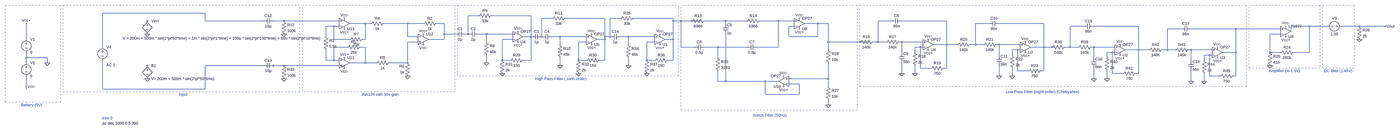
[diagram p0: schematic Prototype 3.asc, whole sheet]
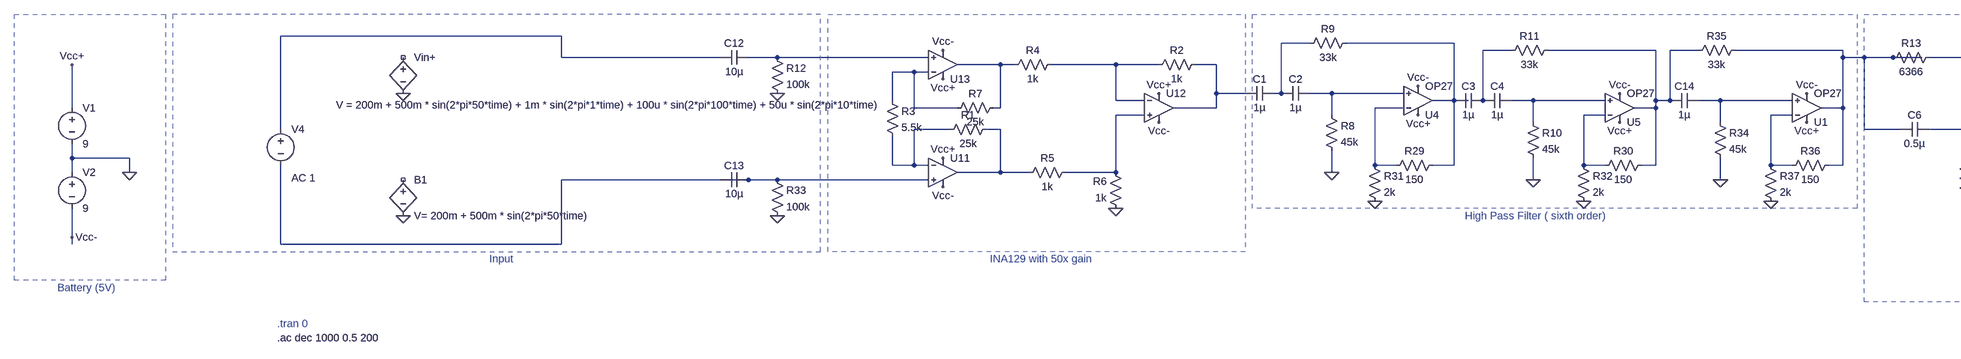
[diagram p1: schematic Prototype 3.asc, part, row 1 of 1, column 1 of 2]
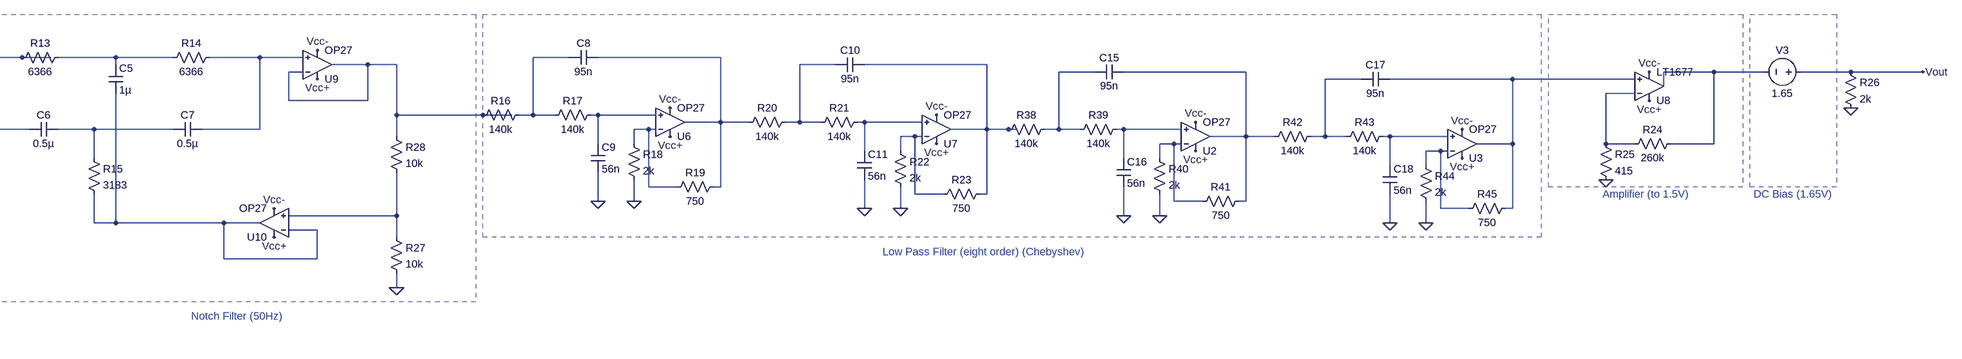
[diagram p2: schematic Prototype 3.asc, part, row 1 of 1, column 2 of 2]
Prototype 3.asc, the LTspice schematic file:
Version 4.1
SHEET 1 7576 680
WIRE -256 -112 -880 -112
WIRE 1408 -96 1344 -96
WIRE 1728 -96 1488 -96
WIRE 1856 -80 1792 -80
WIRE 2176 -80 1936 -80
WIRE 2272 -80 2208 -80
WIRE 2592 -80 2352 -80
WIRE -256 -64 -256 -112
WIRE 96 -64 -256 -64
WIRE 224 -64 160 -64
WIRE 560 -64 224 -64
WIRE 2592 -64 2592 -80
WIRE 2640 -64 2592 -64
WIRE 2704 -64 2640 -64
WIRE 2768 -64 2704 -64
WIRE 2912 -64 2784 -64
WIRE 3040 -64 2912 -64
WIRE 3232 -64 3120 -64
WIRE 3328 -64 3232 -64
WIRE 3920 -64 3840 -64
WIRE 4256 -64 3984 -64
WIRE 720 -48 624 -48
WIRE 752 -48 720 -48
WIRE 976 -48 832 -48
WIRE 1072 -48 976 -48
WIRE 1200 -48 1152 -48
WIRE 2912 -48 2912 -64
WIRE 3472 -48 3392 -48
WIRE 3536 -48 3472 -48
WIRE 4512 -48 4432 -48
WIRE 4848 -48 4576 -48
WIRE 528 -32 480 -32
WIRE 560 -32 528 -32
WIRE 3328 -32 3296 -32
WIRE 5088 -32 5008 -32
WIRE 5424 -32 5152 -32
WIRE 6464 -32 6352 -32
WIRE 6576 -32 6464 -32
WIRE 6768 -32 6656 -32
WIRE 6928 -32 6768 -32
WIRE 5680 -16 5600 -16
WIRE 6016 -16 5744 -16
WIRE 6288 -16 6016 -16
WIRE 6352 0 6352 -32
WIRE 1200 16 1200 -48
WIRE 1264 16 1200 16
WIRE 1344 16 1344 -96
WIRE 1344 16 1328 16
WIRE 1456 16 1408 16
WIRE 1616 16 1456 16
WIRE 6288 16 6224 16
WIRE 480 32 480 -32
WIRE 976 32 976 -48
WIRE 1040 32 976 32
WIRE 1728 32 1728 -96
WIRE 1728 32 1680 32
WIRE 1760 32 1728 32
WIRE 1792 32 1792 -80
WIRE 1904 32 1856 32
WIRE 2064 32 1904 32
WIRE 2176 32 2176 -80
WIRE 2208 32 2208 -80
WIRE 2208 32 2176 32
WIRE 2320 32 2272 32
WIRE 2480 32 2320 32
WIRE 3296 32 3296 -32
WIRE 3472 32 3472 -48
WIRE 3472 32 3296 32
WIRE -1344 48 -1344 -48
WIRE 528 48 528 -32
WIRE 624 48 528 48
WIRE 720 48 720 -48
WIRE 720 48 704 48
WIRE 1200 48 1200 16
WIRE 1200 48 1104 48
WIRE 1616 48 1552 48
WIRE 2176 48 2176 32
WIRE 2176 48 2128 48
WIRE 2592 48 2592 -64
WIRE 2592 48 2544 48
WIRE 1040 64 976 64
WIRE 1456 64 1456 16
WIRE 2064 64 2016 64
WIRE 2480 64 2432 64
WIRE 3536 64 3536 -48
WIRE 3728 64 3536 64
WIRE 3792 64 3728 64
WIRE 3840 64 3840 -64
WIRE 3840 64 3808 64
WIRE 3888 64 3840 64
WIRE 3984 64 3968 64
WIRE 4112 64 3984 64
WIRE 1904 80 1904 32
WIRE 2320 80 2320 32
WIRE 4256 80 4256 -64
WIRE 4256 80 4176 80
WIRE 4320 80 4256 80
WIRE 4432 80 4432 -48
WIRE 4432 80 4400 80
WIRE 4480 80 4432 80
WIRE 4576 80 4560 80
WIRE 4704 80 4576 80
WIRE -880 96 -880 -112
WIRE 608 96 528 96
WIRE 720 96 688 96
WIRE 2640 96 2640 -64
WIRE 2720 96 2640 96
WIRE 2864 96 2784 96
WIRE 3040 96 2864 96
WIRE 3232 96 3232 -64
WIRE 3232 96 3104 96
WIRE 4096 96 4064 96
WIRE 4112 96 4096 96
WIRE 4848 96 4848 -48
WIRE 4848 96 4768 96
WIRE 4896 96 4848 96
WIRE 4912 96 4896 96
WIRE 5008 96 5008 -32
WIRE 5008 96 4976 96
WIRE 5056 96 5008 96
WIRE 5152 96 5136 96
WIRE 5280 96 5152 96
WIRE 3536 112 3536 64
WIRE 4688 112 4656 112
WIRE 4704 112 4688 112
WIRE 5424 112 5424 -32
WIRE 5424 112 5344 112
WIRE 5488 112 5424 112
WIRE 5600 112 5600 -16
WIRE 5600 112 5568 112
WIRE 5648 112 5600 112
WIRE 5744 112 5728 112
WIRE 5872 112 5744 112
WIRE 3984 128 3984 64
WIRE 4064 128 4064 96
WIRE 5264 128 5232 128
WIRE 5280 128 5264 128
WIRE 6016 128 6016 -16
WIRE 6016 128 5936 128
WIRE 6224 128 6224 16
WIRE 6288 128 6224 128
WIRE 6464 128 6464 -32
WIRE 6464 128 6368 128
WIRE 4576 144 4576 80
WIRE 4656 144 4656 112
WIRE 5856 144 5824 144
WIRE 5872 144 5856 144
WIRE -1344 160 -1344 128
WIRE -1216 160 -1344 160
WIRE 2864 160 2864 96
WIRE 5152 160 5152 96
WIRE 5232 160 5232 128
WIRE 480 176 480 112
WIRE 528 176 528 96
WIRE 528 176 480 176
WIRE 560 176 528 176
WIRE 1552 176 1552 48
WIRE 1600 176 1552 176
WIRE 1728 176 1728 32
WIRE 1728 176 1680 176
WIRE 2016 176 2016 64
WIRE 2064 176 2016 176
WIRE 2176 176 2176 48
WIRE 2176 176 2144 176
WIRE 2432 176 2432 64
WIRE 2480 176 2432 176
WIRE 2592 176 2592 48
WIRE 2592 176 2560 176
WIRE 5744 176 5744 112
WIRE 5824 176 5824 144
WIRE -1344 192 -1344 160
WIRE -1216 192 -1216 160
WIRE 720 192 720 96
WIRE 720 192 624 192
WIRE 784 192 720 192
WIRE 976 192 976 64
WIRE 976 192 864 192
WIRE 1456 192 1456 144
WIRE 96 208 -256 208
WIRE 160 208 112 208
WIRE 224 208 160 208
WIRE 560 208 224 208
WIRE 1904 208 1904 160
WIRE 2320 208 2320 160
WIRE 4096 224 4096 96
WIRE 4160 224 4096 224
WIRE 4256 224 4256 80
WIRE 4256 224 4240 224
WIRE 4688 240 4688 112
WIRE 4752 240 4688 240
WIRE 4848 240 4848 96
WIRE 4848 240 4832 240
WIRE 3984 256 3984 192
WIRE 4064 256 4064 208
WIRE 5264 256 5264 128
WIRE 5328 256 5264 256
WIRE 5424 256 5424 112
WIRE 5424 256 5408 256
WIRE 4576 272 4576 208
WIRE 4656 272 4656 224
WIRE 5856 272 5856 144
WIRE 5920 272 5856 272
WIRE 6016 272 6016 128
WIRE 6016 272 6000 272
WIRE 3536 288 3536 192
WIRE 3536 288 3296 288
WIRE 5152 288 5152 224
WIRE 5232 288 5232 240
WIRE 2864 304 2864 240
WIRE 2912 304 2912 16
WIRE 2912 304 2864 304
WIRE 3152 304 2912 304
WIRE 3232 304 3152 304
WIRE 5744 304 5744 240
WIRE 5824 304 5824 256
WIRE 3360 320 3296 320
WIRE -1344 336 -1344 272
WIRE 3536 336 3536 288
WIRE -1344 352 -1344 336
WIRE -880 352 -880 176
WIRE -256 352 -256 208
WIRE -256 352 -880 352
WIRE 3152 384 3152 304
WIRE 3360 384 3360 320
WIRE 3360 384 3152 384
WIRE 3536 448 3536 416
FLAG -608 16 0
FLAG -608 288 0
FLAG -1216 192 0
FLAG -1344 -48 Vcc+
FLAG -1344 336 Vcc-
FLAG 1456 192 0
FLAG 1904 208 0
FLAG 1648 64 Vcc+
FLAG 2096 80 Vcc+
FLAG 1648 0 Vcc-
FLAG 2096 16 Vcc-
FLAG 3984 256 0
FLAG 4064 256 0
FLAG 4144 112 Vcc+
FLAG 4144 48 Vcc-
FLAG 4576 272 0
FLAG 4656 272 0
FLAG 4736 128 Vcc+
FLAG 4736 64 Vcc-
FLAG 6224 208 0
FLAG 6320 -32 Vcc-
FLAG 6320 32 Vcc+
FLAG 6768 48 0
FLAG 3536 448 0
FLAG 3360 -16 Vcc+
FLAG 3264 336 Vcc+
FLAG 3264 272 Vcc-
FLAG 3360 -80 Vcc-
FLAG 1552 256 0
FLAG 2016 256 0
FLAG 224 16 0
FLAG 976 272 0
FLAG 592 -16 Vcc+
FLAG 592 160 Vcc+
FLAG 1072 16 Vcc+
FLAG 592 -80 Vcc-
FLAG 592 224 Vcc-
FLAG 1072 80 Vcc-
FLAG 224 288 0
FLAG 6928 -32 Vout
FLAG 2320 208 0
FLAG 2512 80 Vcc+
FLAG 2512 16 Vcc-
FLAG 2432 256 0
FLAG 5152 288 0
FLAG 5232 288 0
FLAG 5312 144 Vcc+
FLAG 5312 80 Vcc-
FLAG 5744 304 0
FLAG 5824 304 0
FLAG 5904 160 Vcc+
FLAG 5904 96 Vcc-
SYMBOL bv -608 -80 R0
WINDOW 3 -149 122 Left 2
SYMATTR Value V = 200m + 500m * sin(2*pi*50*time) + 1m * sin(2*pi*1*time) + 100u * sin(2*pi*100*time) + 50u * sin(2*pi*10*time)
SYMATTR InstName Vin+
SYMBOL voltage -1344 32 R0
SYMATTR InstName V1
SYMATTR Value 9
SYMBOL voltage -1344 176 R0
SYMATTR InstName V2
SYMATTR Value 9
SYMBOL cap 1328 0 R90
WINDOW 0 0 32 VBottom 2
WINDOW 3 32 32 VTop 2
SYMATTR InstName C1
SYMATTR Value 1µ
SYMBOL cap 1408 0 R90
WINDOW 0 0 32 VBottom 2
WINDOW 3 32 32 VTop 2
SYMATTR InstName C2
SYMATTR Value 1µ
SYMBOL OpAmps\\OP27 1648 96 M180
SYMATTR InstName U4
SYMBOL res 1440 48 R0
SYMATTR InstName R8
SYMATTR Value 45k
SYMBOL cap 1792 16 R90
WINDOW 0 0 32 VBottom 2
WINDOW 3 32 32 VTop 2
SYMATTR InstName C3
SYMATTR Value 1µ
SYMBOL cap 1856 16 R90
WINDOW 0 0 32 VBottom 2
WINDOW 3 32 32 VTop 2
SYMATTR InstName C4
SYMATTR Value 1µ
SYMBOL OpAmps\\OP27 2096 112 M180
SYMATTR InstName U5
SYMBOL res 1888 64 R0
SYMATTR InstName R10
SYMATTR Value 45k
SYMBOL res 2800 -80 R90
WINDOW 0 0 56 VBottom 2
WINDOW 3 32 56 VTop 2
SYMATTR InstName R13
SYMATTR Value 6366
SYMBOL res 3136 -80 R90
WINDOW 0 0 56 VBottom 2
WINDOW 3 32 56 VTop 2
SYMATTR InstName R14
SYMATTR Value 6366
SYMBOL cap 2896 -48 R0
SYMATTR InstName C5
SYMATTR Value 1µ
SYMBOL cap 2784 80 R90
WINDOW 0 0 32 VBottom 2
WINDOW 3 32 32 VTop 2
SYMATTR InstName C6
SYMATTR Value 0.5µ
SYMBOL cap 3104 80 R90
WINDOW 0 0 32 VBottom 2
WINDOW 3 32 32 VTop 2
SYMATTR InstName C7
SYMATTR Value 0.5µ
SYMBOL res 2848 144 R0
SYMATTR InstName R15
SYMATTR Value 3183
SYMBOL OpAmps\\OP27 4144 144 M180
SYMATTR InstName U6
SYMBOL res 3824 48 R90
WINDOW 0 0 56 VBottom 2
WINDOW 3 32 56 VTop 2
SYMATTR InstName R16
SYMATTR Value 140k
SYMBOL res 3984 48 R90
WINDOW 0 0 56 VBottom 2
WINDOW 3 32 56 VTop 2
SYMATTR InstName R17
SYMATTR Value 140k
SYMBOL cap 3984 -80 R90
WINDOW 0 0 32 VBottom 2
WINDOW 3 32 32 VTop 2
SYMATTR InstName C8
SYMATTR Value 95n
SYMBOL cap 3968 128 R0
SYMATTR InstName C9
SYMATTR Value 56n
SYMBOL res 4048 112 R0
SYMATTR InstName R18
SYMATTR Value 2k
SYMBOL res 4256 208 R90
WINDOW 0 0 56 VBottom 2
WINDOW 3 32 56 VTop 2
SYMATTR InstName R19
SYMATTR Value 750
SYMBOL OpAmps\\OP27 4736 160 M180
SYMATTR InstName U7
SYMBOL res 4416 64 R90
WINDOW 0 0 56 VBottom 2
WINDOW 3 32 56 VTop 2
SYMATTR InstName R20
SYMATTR Value 140k
SYMBOL res 4576 64 R90
WINDOW 0 0 56 VBottom 2
WINDOW 3 32 56 VTop 2
SYMATTR InstName R21
SYMATTR Value 140k
SYMBOL cap 4576 -64 R90
WINDOW 0 0 32 VBottom 2
WINDOW 3 32 32 VTop 2
SYMATTR InstName C10
SYMATTR Value 95n
SYMBOL cap 4560 144 R0
SYMATTR InstName C11
SYMATTR Value 56n
SYMBOL res 4640 128 R0
SYMATTR InstName R22
SYMATTR Value 2k
SYMBOL res 4848 224 R90
WINDOW 0 0 56 VBottom 2
WINDOW 3 32 56 VTop 2
SYMATTR InstName R23
SYMATTR Value 750
SYMBOL OpAmps\\LT1677 6320 64 M180
SYMATTR InstName U8
SYMBOL res 6384 112 R90
WINDOW 0 0 56 VBottom 2
WINDOW 3 32 56 VTop 2
SYMATTR InstName R24
SYMATTR Value 260k
SYMBOL res 6208 112 R0
SYMATTR InstName R25
SYMATTR Value 415
SYMBOL res 6752 -48 R0
SYMATTR InstName R26
SYMATTR Value 2k
SYMBOL voltage 6672 -32 R90
WINDOW 0 -32 56 VBottom 2
WINDOW 3 32 56 VTop 2
SYMATTR InstName V3
SYMATTR Value 1.65
SYMBOL cap 160 -80 R90
WINDOW 0 0 32 VBottom 2
WINDOW 3 32 32 VTop 2
SYMATTR InstName C12
SYMATTR Value 10µ
SYMBOL res 208 -80 R0
SYMATTR InstName R12
SYMATTR Value 100k
SYMBOL voltage -880 80 R0
WINDOW 123 24 124 Left 2
WINDOW 39 0 0 Left 0
SYMATTR Value2 AC 1
SYMATTR InstName V4
SYMATTR Value ""
SYMBOL OpAmps\\OP27 3360 16 M180
SYMATTR InstName U9
SYMBOL OpAmps\\OP27 3264 368 R180
SYMATTR InstName U10
SYMBOL res 3520 320 R0
SYMATTR InstName R27
SYMATTR Value 10k
SYMBOL res 3520 96 R0
SYMATTR InstName R28
SYMATTR Value 10k
SYMBOL res 1504 -112 R90
WINDOW 0 0 56 VBottom 2
WINDOW 3 32 56 VTop 2
SYMATTR InstName R9
SYMATTR Value 33k
SYMBOL res 1952 -96 R90
WINDOW 0 0 56 VBottom 2
WINDOW 3 32 56 VTop 2
SYMATTR InstName R11
SYMATTR Value 33k
SYMBOL res 1696 160 R90
WINDOW 0 0 56 VBottom 2
WINDOW 3 32 56 VTop 2
SYMATTR InstName R29
SYMATTR Value 150
SYMBOL res 2160 160 R90
WINDOW 0 0 56 VBottom 2
WINDOW 3 32 56 VTop 2
SYMATTR InstName R30
SYMATTR Value 150
SYMBOL res 1536 160 R0
SYMATTR InstName R31
SYMATTR Value 2k
SYMBOL res 2000 160 R0
SYMATTR InstName R32
SYMATTR Value 2k
SYMBOL res 704 80 R90
WINDOW 0 0 56 VBottom 2
WINDOW 3 32 56 VTop 2
SYMATTR InstName R1
SYMATTR Value 25k
SYMBOL res 720 32 R90
WINDOW 0 0 56 VBottom 2
WINDOW 3 32 56 VTop 2
SYMATTR InstName R7
SYMATTR Value 25k
SYMBOL res 464 16 R0
SYMATTR InstName R3
SYMATTR Value 5.5k
SYMBOL res 848 -64 R90
WINDOW 0 0 56 VBottom 2
WINDOW 3 32 56 VTop 2
SYMATTR InstName R4
SYMATTR Value 1k
SYMBOL res 880 176 R90
WINDOW 0 0 56 VBottom 2
WINDOW 3 32 56 VTop 2
SYMATTR InstName R5
SYMATTR Value 1k
SYMBOL res 992 288 R180
WINDOW 0 36 76 Left 2
WINDOW 3 36 40 Left 2
SYMATTR InstName R6
SYMATTR Value 1k
SYMBOL res 1168 -64 R90
WINDOW 0 0 56 VBottom 2
WINDOW 3 32 56 VTop 2
SYMATTR InstName R2
SYMATTR Value 1k
SYMBOL cap 160 192 R90
WINDOW 0 0 32 VBottom 2
WINDOW 3 32 32 VTop 2
SYMATTR InstName C13
SYMATTR Value 10µ
SYMBOL res 208 192 R0
SYMATTR InstName R33
SYMATTR Value 100k
SYMBOL OpAmps\\UniversalOpAmp2 592 192 R0
SYMATTR InstName U11
SYMBOL OpAmps\\UniversalOpAmp2 1072 48 R0
SYMATTR InstName U12
SYMBOL OpAmps\\UniversalOpAmp2 592 -48 M180
SYMATTR InstName U13
SYMBOL cap 2272 16 R90
WINDOW 0 0 32 VBottom 2
WINDOW 3 32 32 VTop 2
SYMATTR InstName C14
SYMATTR Value 1µ
SYMBOL OpAmps\\OP27 2512 112 M180
SYMATTR InstName U1
SYMBOL res 2304 64 R0
SYMATTR InstName R34
SYMATTR Value 45k
SYMBOL res 2368 -96 R90
WINDOW 0 0 56 VBottom 2
WINDOW 3 32 56 VTop 2
SYMATTR InstName R35
SYMATTR Value 33k
SYMBOL res 2576 160 R90
WINDOW 0 0 56 VBottom 2
WINDOW 3 32 56 VTop 2
SYMATTR InstName R36
SYMATTR Value 150
SYMBOL res 2416 160 R0
SYMATTR InstName R37
SYMATTR Value 2k
SYMBOL OpAmps\\OP27 5312 176 M180
SYMATTR InstName U2
SYMBOL res 4992 80 R90
WINDOW 0 0 56 VBottom 2
WINDOW 3 32 56 VTop 2
SYMATTR InstName R38
SYMATTR Value 140k
SYMBOL res 5152 80 R90
WINDOW 0 0 56 VBottom 2
WINDOW 3 32 56 VTop 2
SYMATTR InstName R39
SYMATTR Value 140k
SYMBOL cap 5152 -48 R90
WINDOW 0 0 32 VBottom 2
WINDOW 3 32 32 VTop 2
SYMATTR InstName C15
SYMATTR Value 95n
SYMBOL cap 5136 160 R0
SYMATTR InstName C16
SYMATTR Value 56n
SYMBOL res 5216 144 R0
SYMATTR InstName R40
SYMATTR Value 2k
SYMBOL res 5424 240 R90
WINDOW 0 0 56 VBottom 2
WINDOW 3 32 56 VTop 2
SYMATTR InstName R41
SYMATTR Value 750
SYMBOL OpAmps\\OP27 5904 192 M180
SYMATTR InstName U3
SYMBOL res 5584 96 R90
WINDOW 0 0 56 VBottom 2
WINDOW 3 32 56 VTop 2
SYMATTR InstName R42
SYMATTR Value 140k
SYMBOL res 5744 96 R90
WINDOW 0 0 56 VBottom 2
WINDOW 3 32 56 VTop 2
SYMATTR InstName R43
SYMATTR Value 140k
SYMBOL cap 5744 -32 R90
WINDOW 0 0 32 VBottom 2
WINDOW 3 32 32 VTop 2
SYMATTR InstName C17
SYMATTR Value 95n
SYMBOL cap 5728 176 R0
SYMATTR InstName C18
SYMATTR Value 56n
SYMBOL res 5808 160 R0
SYMATTR InstName R44
SYMATTR Value 2k
SYMBOL res 6016 256 R90
WINDOW 0 0 56 VBottom 2
WINDOW 3 32 56 VTop 2
SYMATTR InstName R45
SYMATTR Value 750
SYMBOL bv -608 192 R0
SYMATTR InstName B1
SYMATTR Value V= 200m + 500m * sin(2*pi*50*time)
TEXT -416 384 Left 2 ;Input
TEXT -1376 448 Left 2 ;Battery (5V)
TEXT 696 384 Left 2 ;INA129 with 50x gain
TEXT 1752 288 Left 2 ;High Pass Filter ( sixth order)
TEXT 3080 512 Left 2 ;Notch Filter (50Hz)
TEXT 4616 368 Left 2 ;Low Pass Filter (eight order) (Chebyshev)
TEXT 6216 240 Left 2 ;Amplifier (to 1.5V)
TEXT -888 528 Left 2 ;.tran 0
TEXT 6552 240 Left 2 ;DC Bias (1.65V)
TEXT -888 560 Left 2 !.ac dec 1000 0.5 200
RECTANGLE Normal -1136 432 -1472 -160 1
RECTANGLE Normal 1264 368 336 -160 1
RECTANGLE Normal 6528 224 6096 -160 1
RECTANGLE Normal -1120 368 320 -160 1
RECTANGLE Normal 6736 224 6544 -160 1
RECTANGLE Normal 2624 272 1280 -160 1
RECTANGLE Normal 3712 480 2640 -160 1
RECTANGLE Normal 6080 336 3728 -160 1

The netlist it stands for:
* Prototype 3.asc
B§Vin+ NC_01 0 V = 200m + 500m * sin(2*pi*50*time) + 1m * sin(2*pi*1*time) + 100u * sin(2*pi*100*time) + 50u * sin(2*pi*10*time)
V1 Vcc+ 0 9
V2 0 Vcc- 9
C1 N002 N014 1µ
C2 N024 N002 1µ
X§U4 N024 N028 Vcc+ Vcc- N003 OP27  ; pins In+ In- V+ V- OUT
R8 N024 0 45k
C3 N004 N003 1µ
C4 N026 N004 1µ
X§U5 N026 N030 Vcc+ Vcc- N005 OP27  ; pins In+ In- V+ V- OUT
R10 N026 0 45k
R13 N008 N006 6366
R14 N009 N008 6366
C5 N008 N046 1µ
C6 N036 N006 0.5µ
C7 N009 N036 0.5µ
R15 N036 N046 3183
X§U6 N032 N037 Vcc+ Vcc- N011 OP27  ; pins In+ In- V+ V- OUT
R16 N010 N015 140k
R17 N032 N010 140k
C8 N011 N010 95n
C9 N032 0 56n
R18 N037 0 2k
R19 N011 N037 750
X§U7 N033 N039 Vcc+ Vcc- N017 OP27  ; pins In+ In- V+ V- OUT
R20 N016 N011 140k
R21 N033 N016 140k
C10 N017 N016 95n
C11 N033 0 56n
R22 N039 0 2k
R23 N017 N039 750
X§U8 N023 N025 Vcc+ Vcc- N021 LT1677  ; pins In+ In- V+ V- OUT
R24 N021 N025 260k
R25 N025 0 415
R26 Vout 0 2k
V3 Vout N021 1.65
C12 N007 N001 10µ
R12 N007 0 100k
V4 N001 N043 AC 1
X§U9 N009 N015 Vcc+ Vcc- N015 OP27  ; pins In+ In- V+ V- OUT
X§U10 N045 N046 Vcc+ Vcc- N046 OP27  ; pins In+ In- V+ V- OUT
R27 N045 0 10k
R28 N015 N045 10k
R9 N003 N002 33k
R11 N005 N004 33k
R29 N003 N028 150
R30 N005 N030 150
R31 N028 0 2k
R32 N030 0 2k
R1 N035 N034 25k
R7 N012 N018 25k
R3 N018 N034 5.5k
R4 N013 N012 1k
R5 N029 N035 1k
R6 0 N029 1k
R2 N014 N013 1k
C13 N044 N043 10µ
R33 N044 0 100k
X§U11 N044 N034 Vcc+ Vcc- N035 level2 Avol=1Meg GBW=10Meg Slew=10Meg Ilimit=25m Rail=0 Vos=0 En=0 Enk=0 In=0 Ink=0 Rin=500Meg  ; pins In+ In- V+ V- OUT
X§U12 N029 N013 Vcc+ Vcc- N014 level2 Avol=1Meg GBW=10Meg Slew=10Meg Ilimit=25m Rail=0 Vos=0 En=0 Enk=0 In=0 Ink=0 Rin=500Meg  ; pins In+ In- V+ V- OUT
X§U13 N007 N018 Vcc+ Vcc- N012 level2 Avol=1Meg GBW=10Meg Slew=10Meg Ilimit=25m Rail=0 Vos=0 En=0 Enk=0 In=0 Ink=0 Rin=500Meg  ; pins In+ In- V+ V- OUT
C14 N027 N005 1µ
X§U1 N027 N031 Vcc+ Vcc- N006 OP27  ; pins In+ In- V+ V- OUT
R34 N027 0 45k
R35 N006 N005 33k
R36 N006 N031 150
R37 N031 0 2k
X§U2 N038 N041 Vcc+ Vcc- N020 OP27  ; pins In+ In- V+ V- OUT
R38 N019 N017 140k
R39 N038 N019 140k
C15 N020 N019 95n
C16 N038 0 56n
R40 N041 0 2k
R41 N020 N041 750
X§U3 N040 N042 Vcc+ Vcc- N023 OP27  ; pins In+ In- V+ V- OUT
R42 N022 N020 140k
R43 N040 N022 140k
C17 N023 N022 95n
C18 N040 0 56n
R44 N042 0 2k
R45 N023 N042 750
B1 NC_02 0 V= 200m + 500m * sin(2*pi*50*time)
* Input
* Battery (5V)
* INA129 with 50x gain
* High Pass Filter ( sixth order)
* Notch Filter (50Hz)
* Low Pass Filter (eight order) (Chebyshev)
* Amplifier (to 1.5V)
* .tran 0
* DC Bias (1.65V)
.ac dec 1000 0.5 200
.lib ADI.lib
.lib LTC.lib
.lib UniversalOpAmp2.lib
.backanno
.end